# EAGLE design MiniRouter (EAGLE 6.3)
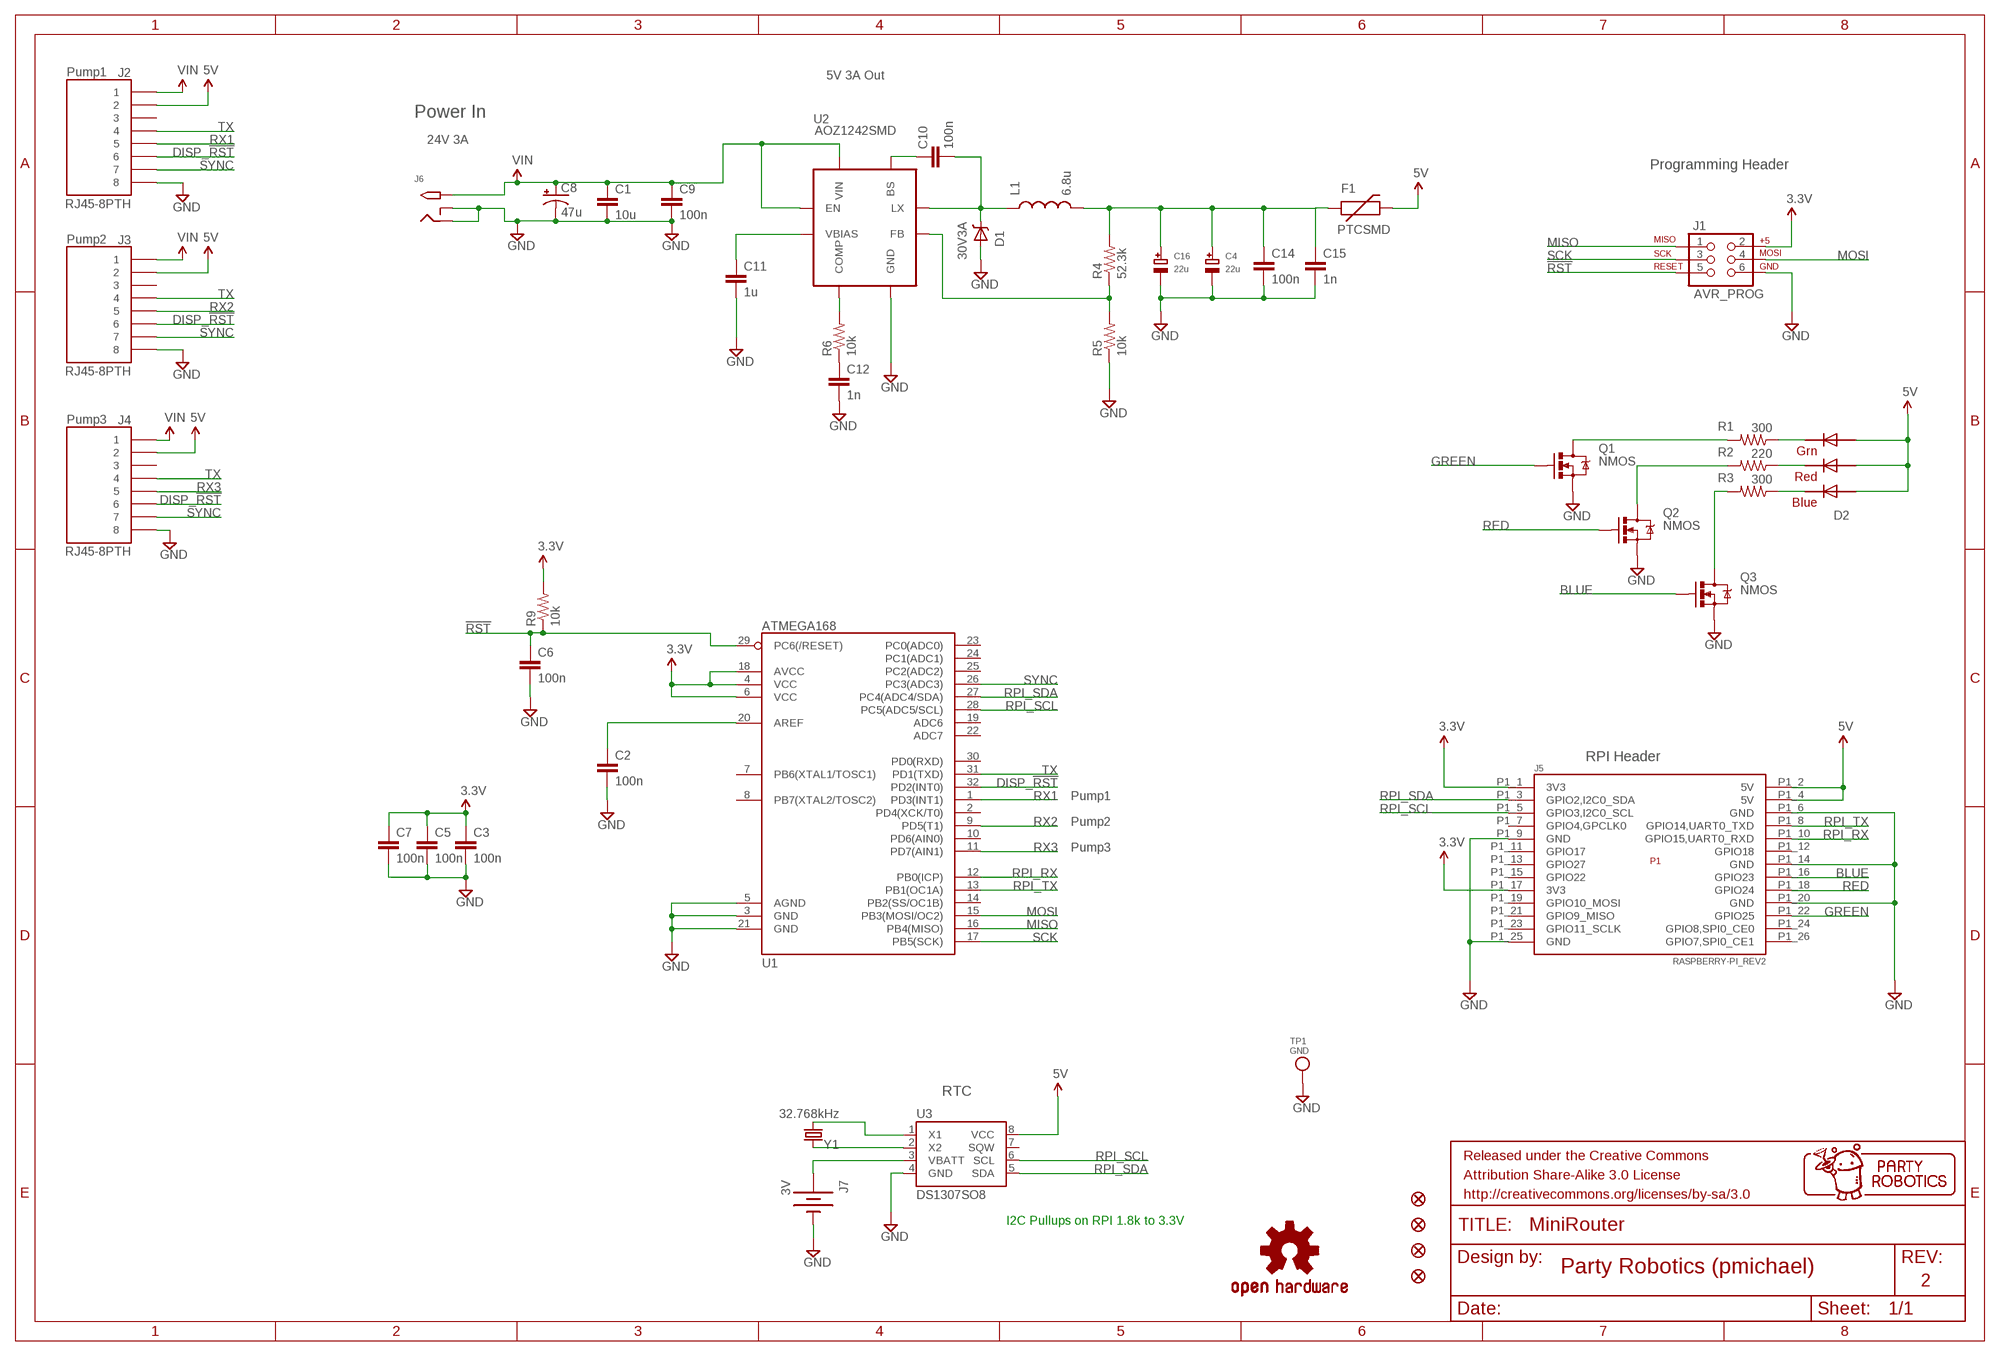
[diagram p0: schematic, sheet 1]

## Parts
C1  10u  CAP1206  [1206]
C2  100n  CAP0603-CAP  [0603-CAP]
C3  100n  CAP0603-CAP  [0603-CAP]
C4  22u  CAP_TANTALUMC/6032_REFLOW  [EIA6032-28/C-R]
C5  100n  CAP0603-CAP  [0603-CAP]
C6  100n  CAP0603-CAP  [0603-CAP]
C7  100n  CAP0603-CAP  [0603-CAP]
C8  47u  CAP_POLD  [PANASONIC_D]
C9  100n  CAP0603-CAP  [0603-CAP]
C10  100n  CAP0603-CAP  [0603-CAP]
C11  1u  CAP0603-CAP  [0603-CAP]
C12  1n  CAP0603-CAP  [0603-CAP]
C14  100n  CAP0603-CAP  [0603-CAP]
C15  1n  CAP0603-CAP  [0603-CAP]
C16  22u  CAP_TANTALUMC/6032_REFLOW  [EIA6032-28/C-R]
D1  30V3A  B330A  [SMA-DIODE]
D2  RGBLED5050  [RGBLED5050]
F1  PTCSMD  [PTC-1206]
FRAME3  FRAME-LETTER  [CREATIVE_COMMONS]
J1  AVR_PROG  AVR_SPI_PRG_62X3_LOCK  [2X3_LOCK]
J2  RJ45-8PTH  [RJ45-8]
J3  RJ45-8PTH  [RJ45-8]
J4  RJ45-8PTH  [RJ45-8]
J5  RASPBERRY-PI_REV2  [RASPBERRY-PI_REV2]
J6  2.1MMJACKTHM  [PJ-102A]
J7  3V  BATTERY12PTH  [BATTCON_12MM_PTH]
JP1  FIDUCIAL1.5X3  [FIDUCIAL-1.5X3]
JP2  FIDUCIAL1.5X3  [FIDUCIAL-1.5X3]
JP3  FIDUCIAL1.5X3  [FIDUCIAL-1.5X3]
JP4  FIDUCIAL1.5X3  [FIDUCIAL-1.5X3]
L1  6.8u  INDUCTORCR54  [IND_8X8X4]
Q1  NMOS  MOSFET-NCHANNELSMD  [SOT23-3]
Q2  NMOS  MOSFET-NCHANNELSMD  [SOT23-3]
Q3  NMOS  MOSFET-NCHANNELSMD  [SOT23-3]
R1  300  RESISTOR0603-RES  [0603-RES]
R2  220  RESISTOR0603-RES  [0603-RES]
R3  300  RESISTOR0603-RES  [0603-RES]
R4  52.3k  RESISTOR0603-RES  [0603-RES]
R5  10k  RESISTOR0603-RES  [0603-RES]
R6  10k  RESISTOR0603-RES  [0603-RES]
R9  10k  RESISTOR0603-RES  [0603-RES]
TP1  GND  TESTPOINT  [TESTPOINT_SMT]
U1  ATMEGA168  [TQFP32-08]
U2  AOZ1242SMD  [SO08]
U3  DS1307SO8  [SO08]
U$46  OSHW-LOGOM  [OSHW-LOGO-M]
Y1  32.768kHz  CRYSTALTC26H_EZ  [TC26HEZ]

## Nets
3.3V: C3.1 C5.1 C7.1 J1.2 J5.P1_1(3V3) J5.P1_17(3V3) R9.2 U1.4(VCC) U1.6(VCC) U1.18(AVCC)
5V: D2.1(BLUE_A) D2.2(RED_A) D2.3(GREEN_A) F1.2 J2.2 J3.2 J4.2 J5.P1_2(5V) J5.P1_4(5V) U3.8(VCC)
!RST: C6.1 J1.5 R9.1 U1.29(PC6(/RESET))
BAT1+: J7.VCC@1(+) U3.3(VBATT)
BLUE: J5.P1_16(GPIO23) Q3.1(G)
DISP_!RST: J2.6 J3.6 J4.6 U1.32(PD2(INT0))
GND: C1.2 C2.2 C3.2 C4.- C5.2 C6.2 C7.2 C8.- C9.2 C11.2 C12.2 C14.2 C15.2 C16.- D1.A J1.6 J2.8 J3.8 J4.8 J5.P1_6(GND) J5.P1_9(GND) J5.P1_14(GND) J5.P1_20(GND) J5.P1_25(GND) J6.RING J6.RING_SW J7.GND(-) Q1.2(S) Q2.2(S) Q3.2(S) R5.1 TP1.P$1 U1.3(GND) U1.5(AGND) U1.21(GND) U2.3(GND) U3.4(GND)
GREEN: J5.P1_22(GPIO25) Q1.1(G)
MISO: J1.1 U1.16(PB4(MISO))
MOSI: J1.4 U1.15(PB3(MOSI/OC2))
N$1: U3.2(X2) Y1.1
N$2: R4.1 R5.2 U2.4(FB)
N$3: R6.2 U2.5(COMP)
N$4: C2.1 U1.20(AREF)
N$5: C4.+ C14.1 C15.1 C16.+ F1.1 L1.P$2 R4.2
N$6: U3.1(X1) Y1.2
N$7: C10.1 U2.2(BS)
N$8: C11.1 U2.8(VBIAS)
N$9: D2.4(GREEN_C) R1.1
N$10: Q1.3(D) R1.2
N$11: Q2.3(D) R2.2
N$12: D2.5(RED_C) R2.1
N$13: D2.6(BLUE_C) R3.1
N$14: Q3.3(D) R3.2
N$15: C12.1 R6.1
N$16: C10.2 D1.C L1.P$1 U2.1(LX)
RED: J5.P1_18(GPIO24) Q2.1(G)
RPI_RX: J5.P1_10(GPIO15,UART0_RXD) U1.12(PB0(ICP))
RPI_SCL: J5.P1_5(GPIO3,I2C0_SCL) U1.28(PC5(ADC5/SCL)) U3.6(SCL)
RPI_SDA: J5.P1_3(GPIO2,I2C0_SDA) U1.27(PC4(ADC4/SDA)) U3.5(SDA)
RPI_TX: J5.P1_8(GPIO14,UART0_TXD) U1.13(PB1(OC1A))
RX1: J2.5 U1.1(PD3(INT1))
RX2: J3.5 U1.9(PD5(T1))
RX3: J4.5 U1.11(PD7(AIN1))
SCK: J1.3 U1.17(PB5(SCK))
SYNC: J2.7 J3.7 J4.7 U1.26(PC3(ADC3))
TX: J2.4 J3.4 J4.4 U1.31(PD1(TXD))
VIN: C1.1 C8.+ C9.1 J2.1 J3.1 J4.1 J6.TIP U2.6(EN) U2.7(VIN)
Unconnected: J2.3 J3.3 J4.3 J5.P1_7(GPIO4,GPCLK0) J5.P1_11(GPIO17) J5.P1_12(GPIO18) J5.P1_13(GPIO27) J5.P1_15(GPIO22) J5.P1_19(GPIO10_MOSI) J5.P1_21(GPIO9_MISO) J5.P1_23(GPIO11_SCLK) J5.P1_24(GPIO8,SPI0_CE0) J5.P1_26(GPIO7,SPI0_CE1) U1.2(PD4(XCK/T0)) U1.7(PB6(XTAL1/TOSC1)) U1.8(PB7(XTAL2/TOSC2)) U1.10(PD6(AIN0)) U1.14(PB2(SS/OC1B)) U1.19(ADC6) U1.22(ADC7) U1.23(PC0(ADC0)) U1.24(PC1(ADC1)) U1.25(PC2(ADC2)) U1.30(PD0(RXD)) U3.7(SQW)

## Notes on the sheet
- Pump1 | 5V 3A Out
- Power In
- 24V 3A
- Programming Header
- Pump2
- Pump3
- RPI Header
- Pump1
- Pump2
- Pump3
- RTC
- I2C Pullups on RPI 1.8k to 3.3V
- Party Robotics (pmichael)
- 2

## Library data of the parts
C1 = SparkFun-Capacitors:CAP: Capacitor Standard 0603 ceramic capacitor, and 0.1" leaded capacitor.
C2 C3 C5-C7 C9-C12 C14 C15 = SparkFun:CAP: Capacitor Standard 0603 ceramic capacitor, and 0.1" leaded capacitor.
C4 C16 = microbuilder:CAP_TANTALUM: Tantalum Capacitors Wave footprints have larger pads and are meant to be used for hand soldering. Reflow footprints are optimised for solder paste and a reflow oven. EIA3216-18/A-[R/W] - Size A / 3216-18 / 1206 footprint 4.7µF 25V 10% Tantalum Capacitor 10µF 16V 10% Tantalum Capacitor [Digikey: 495-2236-2-ND] EIA3528-21/B-[R/W] - Size B / 3528-21 47µF 10V 10% Tantalum Capactior [Digikey: 495-2216-1-ND] EIA6032-28/C-[R/W] - Size C / 6032-28 10µF 35V 20% Tantalum Capacitor [Digikey: 495-2285-1-ND] 100µF 16V 10% Tantalum Capactior [Digikey: 399-5214-1-ND]
C8 = SparkFun-Capacitors:CAP_POL: Capacitor Polarized These are standard SMD and PTH capacitors. Normally 10uF, 47uF, and 100uF in electrolytic and tantalum varieties. Always verify the external diameter of the through hole cap, it varies with capacity, voltage, and manufacturer. The EIA devices should be standard.
D1 = pierre:B330A: Schottky Diode 3A-30V; PROD_ID: DIO-09886
D2 = pierre:RGBLED: For 5050 RGB LEDs, the order of the LEDs may vary from one manufacturer to another!
F1 = SparkFun:PTC: Resettable Fuse PTC Resettable Fuse. Spark Fun Electronics SKU : COM-08357
FRAME3 = SparkFun-Aesthetics:FRAME-LETTER: Schematic Frame Standard 8.5x11 US Letter frame
J1 = SparkFun-Connectors:AVR_SPI_PRG_6: AVR ISP 6 Pin This is the reduced ISP connector for AVR programming. Common on Arduino. This footprint will take up less PCB space and can be used with a 10-pin to 6-pin adapter such as SKU: BOB-08508
J2-J4 = pierre:RJ45-8: RJ45 Jack Simple RJ45, 8-pin connection - connector for common Cat5, Cat5e, and Cat6 Ethernet cables. Footprint not yet proven in production. Connector sku is PRT-00643; Breakout PCB sku is BOB-00716.
J5 = pierre:RASPBERRY-PI_REV2: Raspberry Pi Board <http://www.raspberrypi.org/> Jacques Lagnel V1.0 (beta) 2012 Mateusz Bawaj V1.1 (beta) 2012 Board dimension: Forum 3D model <http://www.raspberrypi.org/forum/general-discussion/mechanical-profile-3d-models?value=3d%20model&type=1&include=1&search=1&ret=all> The GPIO Connector (P1): http://elinux.org/RPi_Low-level_peripherals The GPIO Connector (P5): http://www.raspberrypi-spy.co.uk/2012/09/raspberry-pi-p5-header/
J6 = pierre:2.1MMJACK: 2.1mm x 5.5mm THM DC jack with internal switch. Digikey part #PJ-102A, 4UCON part #05537 2.1mm x 5.5mm SMT DC jack with internal switch. Digikey part #PJ-002A-SMT, 4UCON part #03267 By microbuilder.eu & adafruit.com
J7 = SparkFun-Electromechanical:BATTERY: Battery Holders Various common sizes : AA, AAA, 20mm coin cell and 12mm coin cell.
JP1-JP4 = SparkFun-Aesthetics:FIDUCIAL: Fiducial Alignment Points Various fiducial points for machine vision alignment.
L1 = pierre:INDUCTOR: Inductors Basic Inductor/Choke - 0603 and 1206. Footprints are not proven and vary greatly between part numbers.
Q1-Q3 = SparkFun-DiscreteSemi:MOSFET-NCHANNEL: Generic NMOS footprint
R1-R6 R9 = SparkFun-Resistors:RESISTOR: Resistor Basic schematic elements and footprints for 0603, 1206, and PTH resistors.
TP1 = microbuilder:TESTPOINT: Test Point Various test points for characterisation and PCB testing TESTPOINT_SMT - Compact Surface Mount Test Point [Digikey: 5016KTR-ND]
U1 = SparkFun-DigitalIC:ATMEGA168: Atmel 32-pin 8-bit micro, 16k flash.
U2 = pierre:AOZ1242: Jellybean switching supply controller
U3 = SparkFun-FreqCtrl:DS1307: I2C real-time clock with battery backup.
U$46 = SparkFun-Aesthetics:OSHW-LOGO: Open Source Hardware Logo This logo indicates the piece of hardware it is found on incorporates a OSHW license and/or adheres to the definition of open source hardware found here: http://freedomdefined.org/OSHW
Y1 = pierre:CRYSTAL: Various standard crystals. Proven footprints. Spark Fun Electronics SKU : COM-00534

## Board
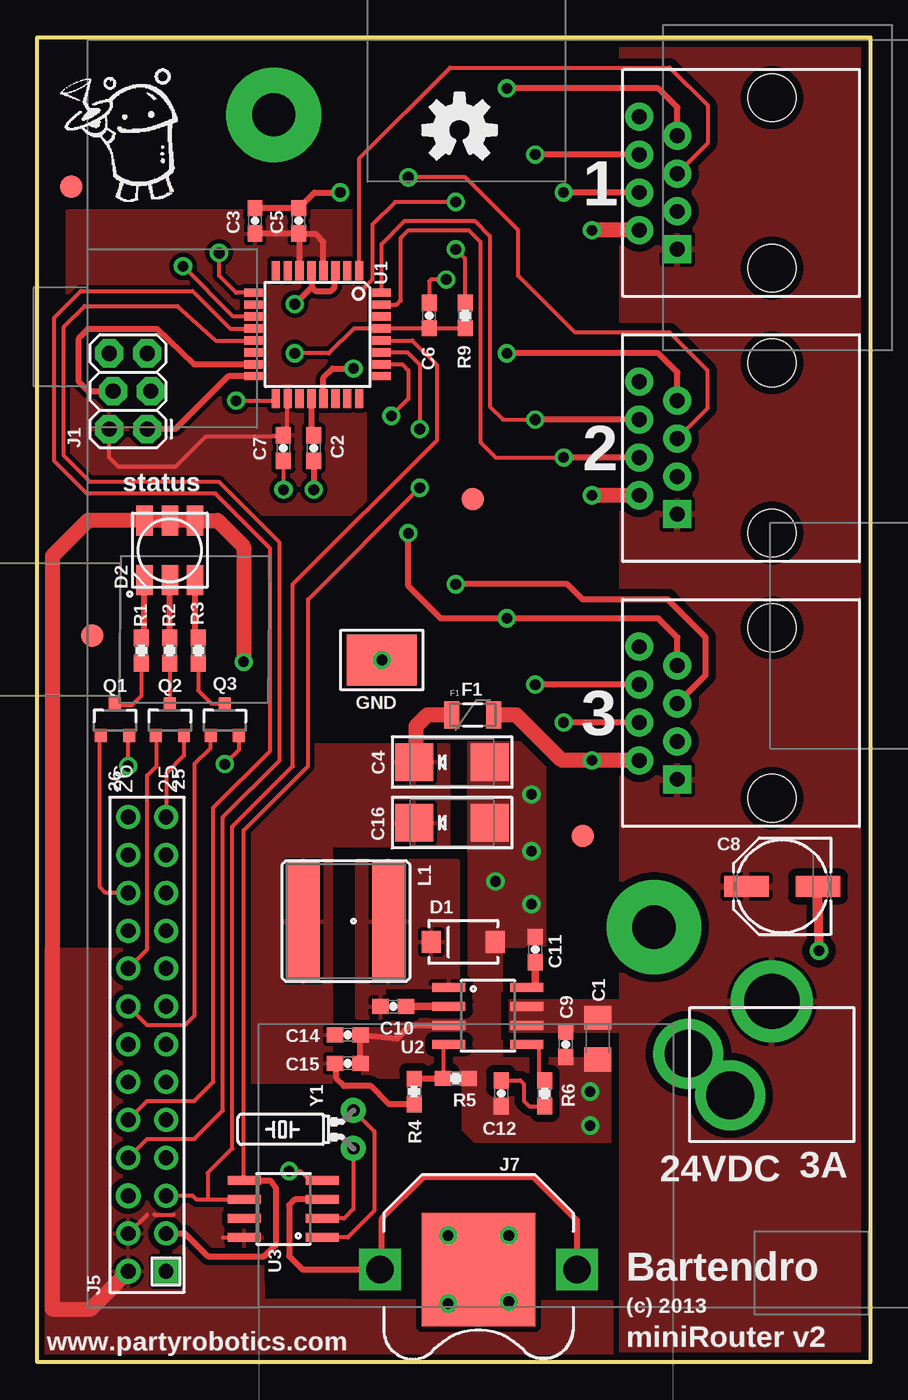
[diagram p1: board, top side]
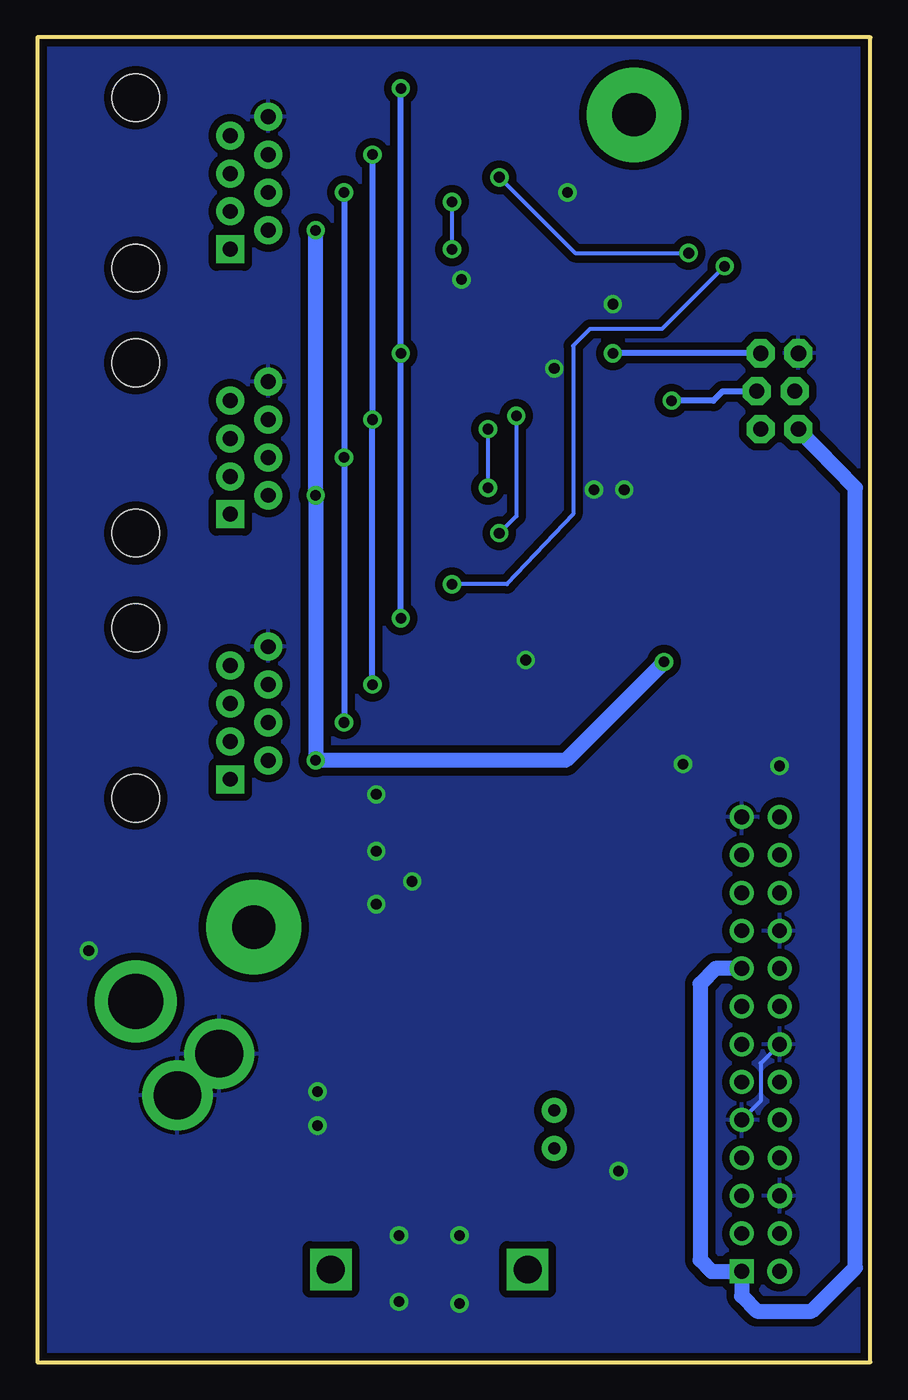
[diagram p2: board, bottom side, seen from below]

Size 55.88 x 88.9 mm. Coordinates in mm from the lower left corner, seen from the top.
Outline: 55.88,0 0,0 0,88.9 55.88,88.9 55.88,0
Copper layers (1*16): Top 0.035mm / dielectric 1.5mm / Bottom 0.035mm
Design rules "SparkFun": minimum track width 8mil, minimum drill 20mil, track to track 8mil, track to pad 8mil, pad to pad 8mil, via to via 8mil, smd to smd 8mil, copper to edge 10mil, drill to drill 8mil, minimum pad ring 12mil, minimum via ring 10mil, stop-mask expansion 4mil, vias tented up to drill 25mil, thermal gap 10mil

### Footprints (pad centres in the part's own frame; a part is rotated, then mirrored left to right if it is on the bottom)
1206 = smd 1.6 x 1.8: 1 -1.4,0; 2 1.4,0
0603-CAP = smd 1.1 x 1: 1 -0.85,0; 2 0.85,0
EIA6032-28/C-R = smd 2.55 x 2.5: + 2.525,0; - -2.525,0
PANASONIC_D = smd 3 x 1.4: + 2.4,0; - -2.4,0
SMA-DIODE = smd 1.27 x 1.47: A -2.15,0; C 2.15,0
RGBLED5050 = smd 2 x 1.1: 1 -2,1.7; 2 -2,0; 3 -2,-1.7; 4 2,-1.7; 5 2,0; 6 2,1.7
PTC-1206 = smd 1 x 1.8: 1 -1.4,0; 2 1.4,0
2X3_LOCK = drill 1.016 pad 1.88 octagon: 1 0,0; 2 0,2.54; 3 2.54,-0.254; 4 2.54,2.286; 5 5.08,0; 6 5.08,2.54
RJ45-8 = drill 1 pad 1.88 square: 1 -4.445,6.35 | drill 1 pad 1.88: 2 -3.175,8.89; 3 -1.905,6.35; 4 -0.635,8.89; 5 0.635,6.35; 6 1.905,8.89; 7 3.175,6.35; 8 4.445,8.89 | hole 3.2: -5.715,0; 5.715,0
RASPBERRY-PI_REV2 = drill 1 square: P1_1 -41.91,21.59 | drill 1 pad 1.676: P1_2 -41.91,24.13; P1_6 -36.83,24.13 | drill 1: P1_3 -39.37,21.59; P1_4 -39.37,24.13; P1_5 -36.83,21.59; P1_7 -34.29,21.59; P1_8 -34.29,24.13; P1_9 -31.75,21.59; P1_10 -31.75,24.13; P1_11 -29.21,21.59; P1_12 -29.21,24.13; P1_13 -26.67,21.59; P1_14 -26.67,24.13; P1_15 -24.13,21.59; P1_16 -24.13,24.13; P1_17 -21.59,21.59; P1_18 -21.59,24.13; P1_19 -19.05,21.59; P1_20 -19.05,24.13; P1_21 -16.51,21.59; P1_22 -16.51,24.13; P1_23 -13.97,21.59; P1_24 -13.97,24.13; P1_25 -11.43,21.59; P1_26 -11.43,24.13 | drill 2.896 pad 6.35: P$1 -18.81,-11.135; P$2 35.69,14.365
PJ-102A = drill 3.2 pad 4.7: RING -1.4,-5.6; RING_SW 1.4,-2.8 | drill 3.7 pad 5.5: TIP -4.9,0
BATTCON_12MM_PTH = smd 7.62 x 7.62: GND 0,0 | drill 1.854 square: VCC@1 -6.604,0; VCC@2 6.604,0
FIDUCIAL-1.5X3 = smd 1.5 x 1.5: 1 0,0
IND_8X8X4 = smd 8 x 2.2: P$1 0,2.85; P$2 0,-2.85
SOT23-3 = smd 0.8 x 0.9: 1 -0.95,-1; 2 0.95,-1; 3 0,1.1
0603-RES = smd 1.1 x 1: 1 -0.85,0; 2 0.85,0
TESTPOINT_SMT = smd 4.7 x 3.4: P$1 0,0
TQFP32-08 = smd 1.27 x 0.559: 1 -4.293,2.8; 2 -4.293,2; 3 -4.293,1.2; 4 -4.293,0.4; 5 -4.293,-0.4; 6 -4.293,-1.2; 7 -4.293,-2; 8 -4.293,-2.8; 17 4.293,-2.8; 18 4.293,-2; 19 4.293,-1.2; 20 4.293,-0.4; 21 4.293,0.4; 22 4.293,1.2; 23 4.293,2; 24 4.293,2.8 | smd 0.559 x 1.27: 9 -2.8,-4.293; 10 -2,-4.293; 11 -1.2,-4.293; 12 -0.4,-4.293; 13 0.4,-4.293; 14 1.2,-4.293; 15 2,-4.293; 16 2.8,-4.293; 25 2.8,4.293; 26 2,4.293; 27 1.2,4.293; 28 0.4,4.293; 29 -0.4,4.293; 30 -1.2,4.293; 31 -2,4.293; 32 -2.8,4.293
SO08 = smd 0.61 x 2.21: 1 -1.905,-2.616; 2 -0.635,-2.616; 3 0.635,-2.616; 4 1.905,-2.616; 5 1.905,2.616; 6 0.635,2.616; 7 -0.635,2.616; 8 -1.905,2.616
TC26HEZ = drill 0.813 pad 1.676: 1 -1.27,0; 2 1.27,0

### Placement (x,y rotation side)
C1  37.59,21.72 270 top
C2  18.54,61.34 270 top
C3  14.61,76.58 90 top
C4  27.81,40.26 180 top
C5  17.53,76.58 90 top
C6  26.29,70.23 90 top
C7  16.51,61.34 270 top
C8  49.96,31.93 180 top
C9  35.43,21.34 270 top
C10  23.88,23.88 180 top
C11  33.4,27.69 90 top
C12  31.11,18.03 270 top
C14  20.83,21.97 0 top
C15  20.83,20.07 0 top
C16  27.81,36.2 180 top
D1  28.57,28.19 180 top
D2  8.89,54.48 270 top
F1  29.21,43.43 0 top
FRAME3  18.8,-10.41 0 top  (outside the outline)
J1  7.37,62.61 90 top
J2  49.28,79.12 90 top
J3  49.28,61.34 90 top
J4  49.28,43.56 90 top
J5  30.23,48.01 90 top
J6  49.28,19.3 270 top
J7  29.59,6.22 180 top
JP1  29.21,57.91 270 top
JP2  3.68,48.77 90 top
JP3  36.58,35.31 90 top
JP4  2.29,78.87 90 top
L1  20.7,29.59 270 top
Q1  5.21,43.05 0 top
Q2  8.89,43.05 0 top
Q3  12.57,43.05 0 top
R1  6.99,47.75 270 top
R2  8.89,47.75 270 top
R3  10.79,47.75 270 top
R4  25.27,18.16 270 top
R5  28.07,19.05 180 top
R6  34.04,18.03 90 top
R9  28.7,70.23 90 top
TP1  23.11,47.12 180 top
U1  18.8,68.96 270 top
U2  30.23,23.24 270 top
U3  16.51,10.29 90 top
U$46  28.32,82.68 0 top
Y1  21.21,15.62 90 top

### Tracks (layer width: path | path; a pad name or v marks a point on that pad's centre or on a via)
3.3V  (via drill 0.71)
  Top 0.254: U1.18 16.76,64.64 16.76,62.45 C7.1 16.42,62.1 11.3,62.1 9.27,60.07 5.46,60.07 4.83,60.71 J1.2 | R9.2 28.7,74.04 v28.07,74.68 | v28.07,77.85 24,77.85 22.48,76.33 22.48,72.64 21.84,72.01
  Top 0.406: U1.6 17.6,75.73 C5.1 | C5.1 C3.1 | U1.4 19.2,75.17 18.67,75.69 17.57,75.69 C5.1
  Bottom 0.254: v28.07,77.85 v28.07,74.68
  Bottom 1.016: J1.2 1.02,58.67 1.02,6.35 3.94,3.43 7.62,3.43 8.64,4.45 J5.P1_1 10.67,6.1 11.43,6.86 11.43,25.4 10.41,26.42 J5.P1_17
  pour Top (isolate 0.305, rank 2): 2.03,77.22 21.97,77.22 21.97,56.9 2.03,56.9
5V  (via drill 0.71)
  Top 0.254: J5.P1_4 7.37,9.91 | 12.45,8.38 U3.8 | 7.87,9.91 9.14,9.91
  Top 0.406: D2.3 D2.2 D2.1
  Top 1.016: J2.2 v37.21,75.95 | J3.2 v37.21,58.17 | J4.2 v37.21,40.39 35.18,40.39 32.13,43.43 F1.2 | J5.P1_2 3.56,3.56 1.02,3.56 1.02,54.1 3.4,56.48 D2.1 12.1,56.48 13.84,54.74 v13.84,46.99
  Bottom 1.016: v37.21,75.95 v37.21,58.17 v37.21,40.39 20.45,40.39 v13.84,46.99
  pour Top (isolate 0.381): 6.86,18.67 14.99,12.95 15.11,4.19 38.48,4.06 38.48,0 0,0 0,27.69 6.99,27.69
!RST  (via drill 0.71)
  Top 0.254: v17.27,67.69 19.56,67.69 21.23,69.36 U1.29 23.11,69.38 C6.1 R9.1
  Bottom 0.406: J1.5 v17.27,67.69
BAT1+
  Top 0.254: 22.99,6.22 23.11,6.35
  Top 0.406: U3.3 17.27,10.92 16.89,10.54 16.89,7.11 17.78,6.22 22.99,6.22 | 23.11,6.35 23.11,9.65 25.91,12.45 33.27,12.45 36.2,9.53 J7.VCC@1
BLUE
  Top 0.254: J5.P1_16 7.37,22.61 9.91,22.61 10.54,23.24 10.54,40.13 11.62,41.21 Q3.1
DISP_!RST  (via drill 0.71)
  Top 0.254: U1.32 23.09,75.03 24.64,76.58 29.34,76.58 30.35,75.56 30.35,64.14 31.24,63.25 v33.4,63.25
  Top 0.406: J2.6 v33.4,81.03 | J3.6 v33.4,63.25 | 34.67,45.47 J4.6 v33.4,45.47
  Bottom 0.406: v33.4,45.47 v33.4,63.25 v33.4,81.03
GND  (via drill 0.71)
  Top 0.203: J7.GND v31.62,8.51
  Top 0.254: Q2.2 9.84,40.7 8.64,39.5 J5.P1_25 | Q3.2 13.52,41.08 v12.57,40.13 | v6.1,40.01 6.1,41.99 Q1.2 | C7.2 v16.51,58.55 | 19.18,12.24 arc-90 U3.4 19.05,12.27 18.29,12.19 17.65,12.83 v16.89,12.83 | v27.43,72.64 26.42,72.64 26.29,72.52 C6.2
  Top 0.406: C2.2 v18.54,58.55 | U1.3 19.94,73.2 19.94,72.14 19.68,71.88 18.67,71.88 18.4,72.16 U1.5 18.4,72.12 v17.27,70.99 | U1.21 19.2,66.06 19.81,66.67 v21.21,66.67 | C3.2 C5.2 18.58,78.49 v20.32,78.49 | C15.2 C14.2 24.13,21.72 25.02,22.61 U2.3
  Top 0.61: C8.- v52.43,27.61
  Top 1.016: C8.- 52.42,31.87
  Bottom 0.254: J5.P1_14 7.37,20.07 7.37,17.53 J5.P1_9
  other vias: 33.15,30.73 33.15,38.1 33.15,34.29 30.73,32.26 37.08,18.16 37.08,15.88 31.62,4.06 27.56,8.51 27.56,3.94 23.11,47.12
  pour Top (isolate 0.508, rank 2, no thermals): 32.38,41.53 28.96,41.53 28.96,22.99 21.84,22.99 21.84,19.18 28.57,19.18 28.57,15.62 29.34,14.86 38.48,14.86 38.48,20.32 31.11,20.32 31.11,27.94 34.04,27.94 34.04,39.88
  pour Bottom (isolate 0.508): 0,88.9 55.88,88.9 55.88,0 0,0
GREEN
  Top 0.254: J5.P1_22 4.57,31.5 4.19,31.88 4.19,41.99 Q1.1
MISO
  Top 0.406: U1.16 12.82,66.16 9.27,62.61 J1.1
MOSI
  Top 0.406: U1.15 10.51,66.96 8,69.34 3.43,69.34 2.79,68.71 2.79,65.79 3.43,65.15 J1.4
N$1
  Top 0.254: Y1.1 21.21,10.29 20.57,9.65 U3.2
N$2
  Top 0.254: U2.4 27.22,21.32 R5.2
  Top 0.406: R5.2 27.18,19.01 R4.1
N$3
  Top 0.254: R6.2 33.66,18.8 33.66,21.34 U2.5
N$4
  Top 0.406: C2.1 18.4,61.83 U1.20
N$5
  Top 0.406: R4.2 23.58,17.31 22.35,18.54 20.57,18.54 20.07,19.05 20.07,19.98 C15.1
  Top 1.016: F1.1 26.16,43.43 25.4,42.67 25.4,40.37 C4.+
  pour Top (isolate 0.305): 14.48,41.4 27.56,41.4 27.56,34.67 19.68,34.67 19.68,18.8 14.48,18.8
N$6
  Top 0.254: Y1.2 22.61,15.49 22.61,10.16 20.83,8.38 U3.1
N$7
  Top 0.508: U2.2 C10.1
N$8
  Top 0.203: U2.8 33.4,25.15
  Top 0.508: C11.1 33.4,25.15
N$9
  Top 0.406: R1.1 7.19,48.55 D2.4
N$10
  Top 0.254: R1.2 6.99,44.7 6.35,44.07 5.29,44.07 Q1.3
N$11
  Top 0.254: R2.2 Q2.3
N$12
  Top 0.406: R2.1 D2.5
N$13
  Top 0.406: R3.1 10.59,48.55 D2.6
N$14
  Top 0.254: R3.2 10.79,45.09 11.68,44.2 12.53,44.2 Q3.3
N$15
  Top 0.254: C12.1 31.54,18.92 32.38,18.92 32.64,18.67 32.64,17.53 32.98,17.18 R6.1
N$16
  pour Top: 21.46,33.66 28.19,33.66 28.19,25.15 23.24,25.15 23.24,23.11 21.46,23.11
RED
  Top 0.254: J5.P1_18 7.37,27.69 7.37,39.37 8,40.01 8,41.99 Q2.1
RPI_RX
  Top 0.254: J5.P1_10 7.37,17.53 10.54,17.53 11.81,18.8 11.81,37.21 15.62,41.02 15.62,54.61 11.94,58.29 3.3,58.29 1.14,60.45 1.14,70.1 2.92,71.88 10.41,71.88 12.94,69.36 U1.12
RPI_SCL
  Top 0.254: U1.28 25.16,68.56 26.8,66.93 26.8,61.85 17.14,52.2 17.14,40.01 13.08,35.94 13.08,14.35 11.43,12.7 11.43,10.92 | 11.43,10.92 10.67,10.92 10.41,11.18 J5.P1_5 | 11.43,10.92 U3.6
RPI_SDA  (via drill 0.71)
  Top 0.254: v25.65,58.67 18.16,51.18 18.16,40.01 13.84,35.69 13.84,12.24 U3.5 | U1.27 24.82,67.76 25.65,66.93 v25.65,62.61
  Top 0.406: U3.5 15.62,12.19 16,11.68 16,7.87 15.24,7.11 11.43,7.11 9.91,8.64 J5.P1_3
  Bottom 0.254: v25.65,62.61 v25.65,58.67
RPI_TX
  Top 0.254: J5.P1_8 7.37,14.99 10.54,14.99 12.45,16.89 12.45,36.58 16.26,40.39 16.26,54.99 12.19,59.05 3.56,59.05 1.78,60.83 1.78,69.47 3.17,70.87 9.4,70.87 11.96,68.56 U1.13
RX1
  Top 0.254: U1.1 21.6,80.78 27.69,86.87 42.42,86.87 44.96,84.33 44.96,81.79 J2.5
RX2  (via drill 0.74)
  Top 0.254: U1.9 13.33,71.76 12.19,72.9 v12.19,74.42 | J3.5 44.96,64.01 44.96,66.55 42.42,69.09 36.07,69.09 32.26,72.9 32.26,75.95 28.7,79.5 v24.89,79.5
  Bottom 0.254: v24.89,79.5 19.81,74.42 v12.19,74.42
RX3  (via drill 0.71)
  Top 0.254: U1.11 13.15,70.16 v9.78,73.53
  Top 0.406: J4.5 44.83,46.1 44.83,48.64 42.29,51.18 36.58,51.18 35.56,52.2 v28.07,52.2
  Bottom 0.254: v28.07,52.2 24.38,52.2 19.94,56.9 19.94,68.2 18.8,69.34 13.97,69.34 v9.78,73.53
SCK  (via drill 0.71)
  Top 0.254: v13.34,64.52 15.84,64.52 U1.17
  Bottom 0.406: v13.34,64.52 10.54,64.52 9.91,65.15 J1.3
SYNC  (via drill 0.71)
  Top 0.254: U1.26 24.48,66.96 24.89,66.55 24.89,64.64 v23.75,63.5
  Top 0.406: J2.7 42.93,84.2 41.66,85.47 v31.5,85.47 | J3.7 42.93,66.42 41.66,67.69 v31.5,67.69 | J4.7 42.93,48.64 41.66,49.91 v31.5,49.91 27.05,49.91 24.89,52.07 v24.89,55.63
  Bottom 0.254: v23.75,63.5 23.75,56.77 v24.89,55.63
  Bottom 0.406: v31.5,49.91 v31.5,67.69 v31.5,85.47
TX  (via drill 0.71)
  Top 0.254: U1.31 24.1,70.96 24.38,71.25 24.38,75.44 24.89,75.95 28.96,75.95 29.72,75.18 29.72,61.72 30.73,60.71 v35.31,60.71
  Top 0.406: J3.4 v35.31,60.71 | J2.4 v35.31,78.49 | J4.4 v35.31,42.93
  Bottom 0.406: v35.31,78.49 v35.31,60.71 v35.31,42.93
VIN
  pour Top (isolate 0.508): 39.24,88.65 55.63,88.65 55.63,-0.25 39.24,-0.25
  pour Top (no thermals): 31.75,24.26 39.75,24.26 39.75,22.23 31.75,22.23

### Text on the board
_tplace: 1 | 2 | status | F1 | 3 | 26 | 25 | 24VDC | 3A | Bartendro | (c) 2013 | www.partyrobotics.com | miniRouter v2
_tNames: C3 | C5 | U1 | C6 | R9 | J1 | C7 | C2 | LED1 | R1 | R2 | R3 | Q1 | Q2 | Q3 | C9 | C8 | U3 | Y1 | BAT1
_tValues: 100n | 100n | 10k | 100n | ATMEGA168 | AVR_PROG | 100n | 100n | RGBLED5050 | 300 | 220 | 300 | NMOS | NMOS | NMOS | 100n | 47u | DS1307SO8 | 32.768kHz | 3V